# EAGLE design MEAS-832M1 (EAGLE 7.5.0)
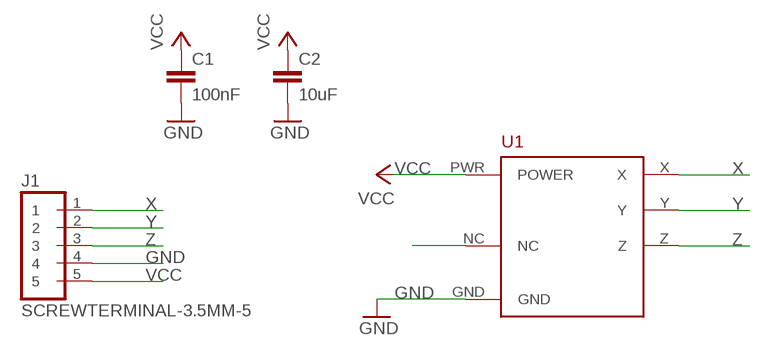
[diagram p0: schematic, sheet 1]

## Parts
C1  100nF  C-EUC0805K  [C0805K]
C2  10uF  C-EUC0805K  [C0805K]
J1  SCREWTERMINAL-3.5MM-5  [SCREWTERMINAL-3.5MM-5]
U1  MEAS-832M1  [MEAS-832M1]

## Nets
GND: C1.2 C2.2 J1.4 U1.GND
N$7: U1.NC
VCC: C1.1 C2.1 J1.5 U1.PWR(POWER)
X: J1.1 U1.X
Y: J1.2 U1.Y
Z: J1.3 U1.Z

## Library data of the parts
C1 C2 = rcl:C-EU: CAPACITOR, European symbol
J1 = libredaq-comps:SCREWTERMINAL-3.5MM-5
U1 = libredaq-comps:MEAS-832M1: MEAS-832M1

## Board
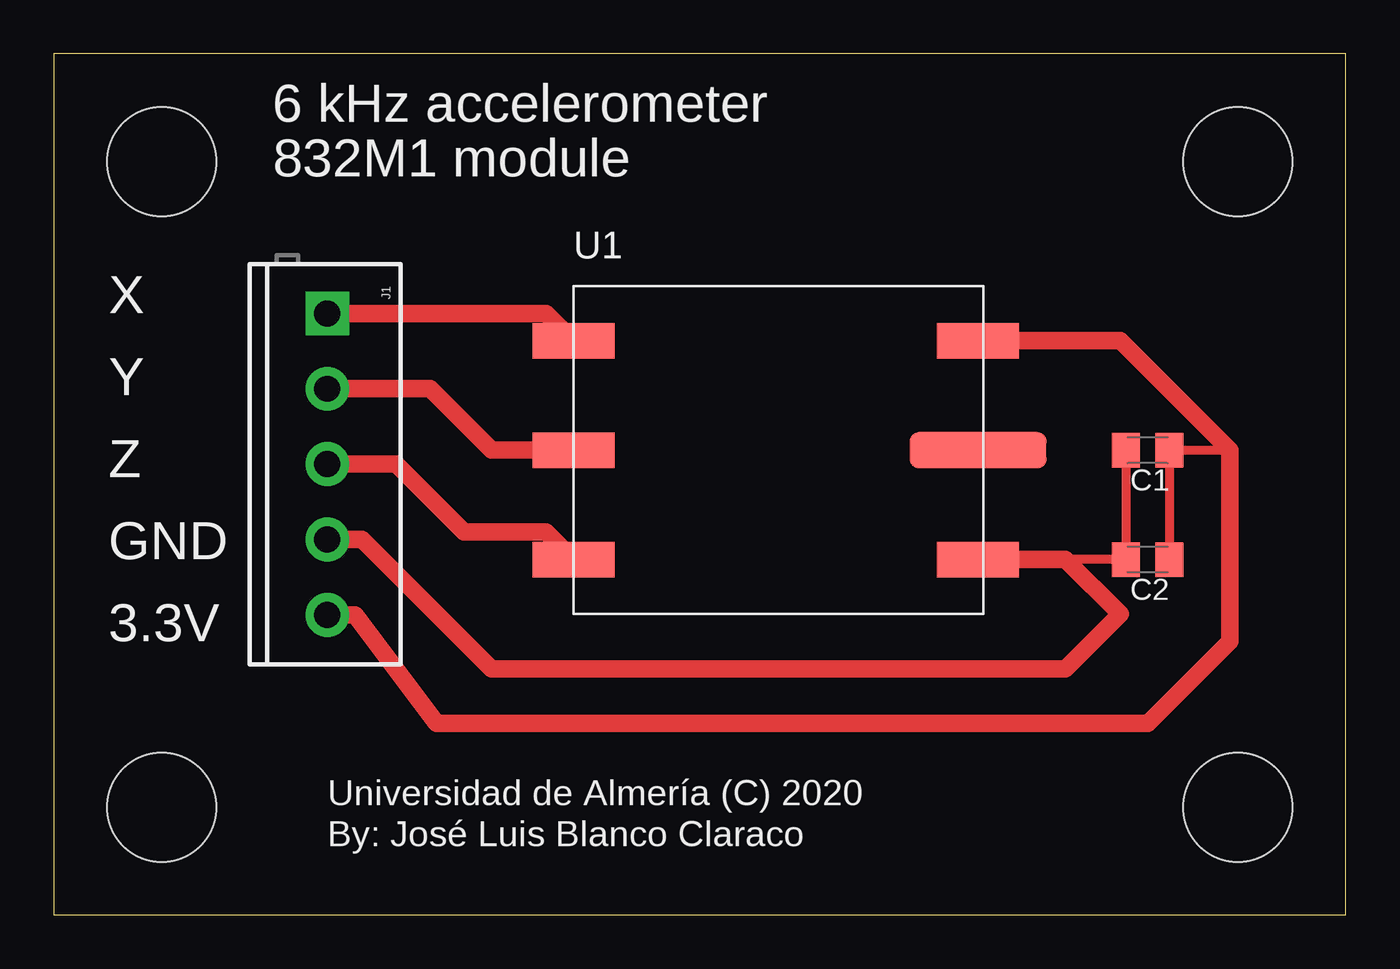
[diagram p1: board, top side]

Size 60 x 40 mm. Coordinates in mm from the lower left corner, seen from the top.
Outline: 0,0 60,0 60,40 0,40 0,0
Copper layers (1*16): Top 0.035mm / dielectric 1.5mm / Bottom 0.035mm
Design rules "default": minimum track width 10mil, minimum drill 24mil, track to track 8mil, track to pad 8mil, pad to pad 8mil, via to via 8mil, smd to smd 8mil, copper to edge 40mil, drill to drill 8mil, minimum pad ring 10mil, minimum via ring 8mil, stop-mask expansion 4mil, vias tented up to drill 0mil, thermal gap 10mil
Holes 5.05 mm at 5,35 5,5 55,35 55,5

### Footprints (pad centres in the part's own frame; a part is rotated, then mirrored left to right if it is on the bottom)
C0805K = smd 1.3 x 1.6: 1 -1,0; 2 1,0
SCREWTERMINAL-3.5MM-5 = drill 1.2 pad 2.032 square: 1 0,0 | drill 1.2 pad 2.032: 2 3.5,0; 3 7,0; 4 10.5,0; 5 14,0
MEAS-832M1 = smd 3.81 x 1.651: GND 18.796,-10.16; PWR 18.796,0; X 0,0; Y 0,-5.08; Z 0,-10.16 | smd 6.35 x 1.651: NC 18.796,-5.08

### Placement (x,y rotation side)
C1  50.8,21.59 180 top
C2  50.8,16.51 180 top
J1  12.7,27.94 270 top
U1  24.13,26.67 0 top

### Tracks (layer width: path | path; a pad name or v marks a point on that pad's centre or on a via)
GND
  Top 0.406: C1.2 C2.2 46.99,16.51
  Top 0.813: J1.4 14.31,17.44 20.32,11.43 46.99,11.43 49.53,13.97 46.99,16.51 U1.GND
VCC
  Top 0.406: 54.61,21.59 C1.1 C2.1
  Top 0.813: J1.5 14,13.94 17.78,8.89 50.8,8.89 54.61,12.7 54.61,21.59 49.53,26.67 U1.PWR
X
  Top 0.813: J1.1 22.86,27.94 U1.X
Y
  Top 0.813: J1.2 17.47,24.44 20.32,21.59 U1.Y
Z
  Top 0.813: J1.3 15.89,20.94 19.05,17.78 22.86,17.78 U1.Z

### Text on the board
tPlace: 6 kHz accelerometer | 832M1 module | X | Y | Z | GND | 3.3V | Universidad de Almería (C) 2020 | By: José Luis Blanco Claraco